# EAGLE schematic MRD104_MICROBOARD_APPS_A (EAGLE 9.2.2), part 1 of 2

## Sheet 1 of 3
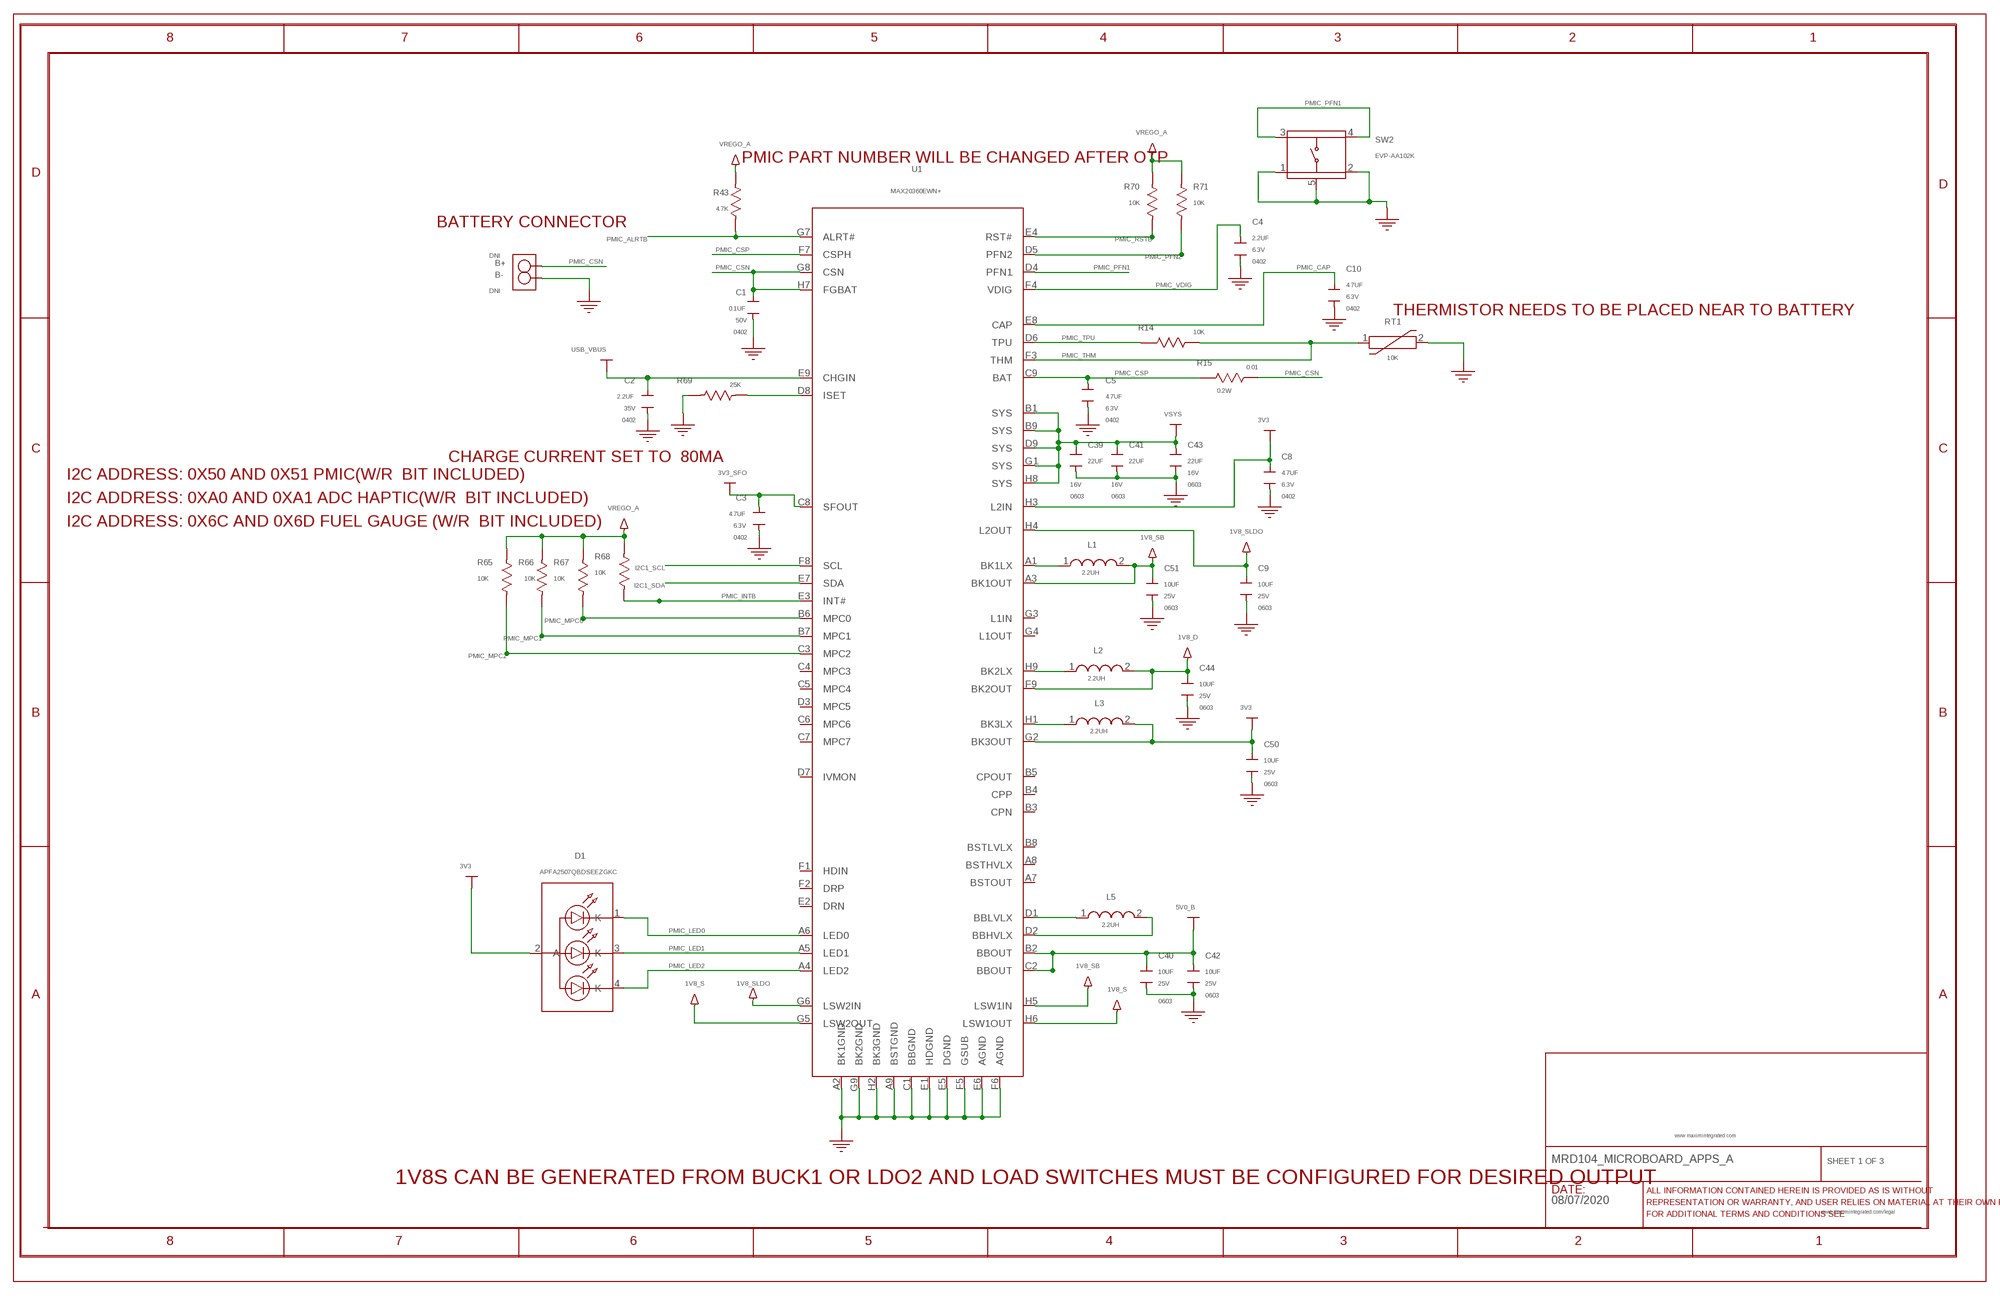
[diagram p0: schematic, sheet 1]
MAXIM_B_SIZE_CF_SYM_1_INST_0 (MAXIM_B_SIZE_CF): COLOR: Default; COMMENT_BODY: TRUE; CURRENT_DESIGN_SHEET: Page 1; CUSTOM_TXT_CDS21: SHEET 1 OF 3; DATE_TXT_CDS: 08/07/2020; DESIGN_CREATE_DATE: Monday, April 19, 2021; DESIGN_CREATE_TIME: 17:19:08; DESIGN_FILE_NAME: C:\TEST\ELGRIS\CHDL2EAGLE\MAXIM\MRD104\MRD104_MICROBOARD_APPS_A.DSN; DESIGN_MODIFY_DATE: Tuesday, April 20, 2021; DESIGN_MODIFY_TIME: 16:35:42; DESIGN_NAME: C:\TEST\ELGRIS\CHDL2EAGLE\MAXIM\MRD104\MRD104_MICROBOARD_APPS_A.DSN; LEGAL_WEBLINK_TXT_CDS: www.maximintegrated.com/legal; LOCATION_X-COORDINATE: 5; LOCATION_Y-COORDINATE: 9; ORIGINALSYMBOLORIGIN: (175,5230); PAGE_CREATE_DATE: Monday, April 19, 2021; PAGE_CREATE_TIME: 17:19:12; PAGE_MODIFY_DATE: Tuesday, April 20, 2021; PAGE_MODIFY_TIME: 16:35:42; PAGE_NUMBER: 1; PAGE_SIZE: Custom; PROJECT_TITLE_TXT_CDS: MRD104_MICROBOARD_APPS_A; SCHEMATIC_CREATE_DATE: Monday, April 19, 2021; SCHEMATIC_CREATE_TIME: 10:19:14; SCHEMATIC_MODIFY_DATE: Tuesday, April 20, 2021; SCHEMATIC_MODIFY_TIME: 09:35:44; SCHEMATIC_NAME: MRD104_MICROBOARD_APPS_A; SCHEMATIC_PAGE_COUNT: 3; SCHEMATIC_PAGE_NUMBER: 1; SOURCE_LIBRARY: D:\MAXIM\CHDL2EAGLE\19APR21\MAXREFDES104\MRD104_MICROBOARD_APPS_A\MML.OLB; SOURCE_SYMBOL: MAXIM_B_SIZE_CF; WEBLINK1_TXT_CDS: www.maximintegrated.com

### Parts
B+  N/A  TP  [KEYS_5001]
B-  N/A  TP  [KEYS_5001]
C1  0.1UF  CAP_NPCAP_NP_2  [0402]
C2  2.2UF  CAP_NPCAP_NP_2  [0402]
C3  4.7UF  CAP_NP#1CAP_NP#1_1  [0402]
C4  2.2UF  CAP_NPCAP_NP_2  [0402]
C5  4.7UF  CAP_NPCAP_NP_2  [0402]
C8  4.7UF  CAP_NPCAP_NP_2  [0402]
C9  10UF  CAP_NPCAP_NP_3  [0603]
C10  4.7UF  CAP_NPCAP_NP_2  [0402]
C39  22UF  CAP_NPCAP_NP_3  [0603]
C40  10UF  CAP_NPCAP_NP_3  [0603]
C41  22UF  CAP_NPCAP_NP_3  [0603]
C42  10UF  CAP_NPCAP_NP_3  [0603]
C43  22UF  CAP_NPCAP_NP_3  [0603]
C44  10UF  CAP_NPCAP_NP_3  [0603]
C50  10UF  CAP_NPCAP_NP_3  [0603]
C51  10UF  CAP_NPCAP_NP_3  [0603]
D1  APFA2507QBDSEEZGKC  LED_4P  [LED_APFA2507]
L1  2.2UH  INDUCTINDUCT_1  [IND_2016]
L2  2.2UH  INDUCTINDUCT_1  [IND_2016]
L3  2.2UH  INDUCTINDUCT_1  [IND_2016]
L5  2.2UH  INDUCTINDUCT_1  [IND_2016]
R14  10K  RES_SMD#1RES_SMD#1_1  [0402]
R15  0.01  RES_SMD#1RES_SMD#1_1  [0402]
R43  4.7K  RES_SMDRES_SMD_2  [0402]
R65  10K  RES_SMDRES_SMD_2  [0402]
R66  10K  RES_SMDRES_SMD_2  [0402]
R67  10K  RES_SMDRES_SMD_2  [0402]
R68  10K  RES_SMDRES_SMD_2  [0402]
R69  25K  RES_SMDRES_SMD_2  [0402]
R70  10K  RES_SMDRES_SMD_2  [0402]
R71  10K  RES_SMDRES_SMD_2  [0402]
RT1  10K  THERMISTOR_SMD  [THRMC0603X33M]
SW2  EVP-AA102K  EVP-AAXXXX  [SW_EVP-AAX02X_GND]
U1  MAX20360EWN+  EK_MAX20360  [MAXIM_21-100373]

### Nets
1V8_D: C44.2 L2.2 U1.F9(BK2OUT) ; also sheet 2,3
1V8_S: U1.G5(LSW2OUT) U1.H6(LSW1OUT) ; also sheet 2
1V8_SB: C51.2 L1.2 U1.A3(BK1OUT) U1.H5(LSW1IN)
1V8_SLDO: C9.2 U1.G6(LSW2IN) U1.H4(L2OUT)
3V3: C8.2 C50.2 D1.2(A) L3.2 U1.G2(BK3OUT) U1.H3(L2IN) ; also sheet 3
3V3_SFO: C3.1 U1.C8(SFOUT) ; also sheet 2,3
5V0_B: C40.2 C42.2 U1.B2(BBOUT) U1.C2(BBOUT) ; also sheet 2
GND_POWER: B-.1(TP1) C1.1 C2.1 C3.2 C4.1 C5.1 C8.1 C9.1 C10.1 C39.1 C40.1 C41.1 C42.1 C43.1 C44.1 C50.1 C51.1 R69.1 RT1.2 SW2.1 SW2.2 SW2.5 U1.A2(BK1GND) U1.A9(BSTGND) U1.C1(BBGND) U1.E1(HDGND) U1.E5(DGND) U1.E6(AGND) U1.F5(GSUB) U1.F6(AGND) U1.G9(BK2GND) U1.H2(BK3GND) ; also sheet 2,3
I2C1_SCL: U1.F8(SCL) ; also sheet 2,3
I2C1_SDA: U1.E7(SDA) ; also sheet 2,3
N00481: L1.1 U1.A1(BK1LX)
N00483: L5.1 U1.D1(BBLVLX)
N00485: L5.2 U1.D2(BBHVLX)
N00491: R69.2 U1.D8(ISET)
N00493: L3.1 U1.H1(BK3LX)
N00495: L2.1 U1.H9(BK2LX)
PMIC_ALRTB: R43.1 U1.G7(ALRT#) ; also sheet 3
PMIC_CAP: C10.2 U1.E8(CAP)
PMIC_CSN: B+.1(TP1) C1.2 R15.2 U1.G8(CSN) U1.H7(FGBAT)
PMIC_CSP: C5.2 R15.1 U1.C9(BAT) U1.F7(CSPH)
PMIC_INTB: R68.1 U1.E3(INT#) ; also sheet 3
PMIC_LED0: D1.1(K) U1.A6(LED0)
PMIC_LED1: D1.3(K) U1.A5(LED1)
PMIC_LED2: D1.4(K) U1.A4(LED2)
PMIC_MPC0: R67.1 U1.B6(MPC0) ; also sheet 3
PMIC_MPC1: R66.1 U1.B7(MPC1) ; also sheet 3
PMIC_MPC2: R65.1 U1.C3(MPC2) ; also sheet 3
PMIC_PFN1: SW2.3 SW2.4 U1.D4(PFN1)
PMIC_PFN2: R71.1 U1.D5(PFN2) ; also sheet 3
PMIC_RSTB: R70.1 U1.E4(RST#) ; also sheet 3
PMIC_THM: R14.2 RT1.1 U1.F3(THM)
PMIC_TPU: R14.1 U1.D6(TPU)
PMIC_VDIG: C4.2 U1.F4(VDIG)
USB_VBUS: C2.2 U1.E9(CHGIN) ; also sheet 2
VREGO_A: R43.2 R65.2 R66.2 R67.2 R68.2 R70.2 R71.2 ; also sheet 2,3
VSYS: C39.2 C41.2 C43.2 U1.B1(SYS) U1.B9(SYS) U1.D9(SYS) U1.G1(SYS) U1.H8(SYS)
Unconnected: U1.A7(BSTOUT) U1.A8(BSTHVLX) U1.B3(CPN) U1.B4(CPP) U1.B5(CPOUT) U1.B8(BSTLVLX) U1.C4(MPC3) U1.C5(MPC4) U1.C6(MPC6) U1.C7(MPC7) U1.D3(MPC5) U1.D7(IVMON) U1.E2(DRN) U1.F1(HDIN) U1.F2(DRP) U1.G3(L1IN) U1.G4(L1OUT)

### Notes on the sheet
- PMIC PART NUMBER WILL BE CHANGED AFTER OTP
- BATTERY CONNECTOR
- THERMISTOR NEEDS TO BE PLACED NEAR TO BATTERY
- CHARGE CURRENT SET TO  80MA
- I2C ADDRESS: 0X50 AND 0X51 PMIC(W/R  BIT INCLUDED)
- I2C ADDRESS: 0XA0 AND 0XA1 ADC HAPTIC(W/R  BIT INCLUDED)
- I2C ADDRESS: 0X6C AND 0X6D FUEL GAUGE (W/R  BIT INCLUDED)
- 1V8S CAN BE GENERATED FROM BUCK1 OR LDO2 AND LOAD SWITCHES MUST BE CONFIGURED FOR DESIRED OUTPUT

## Sheet 2 of 3
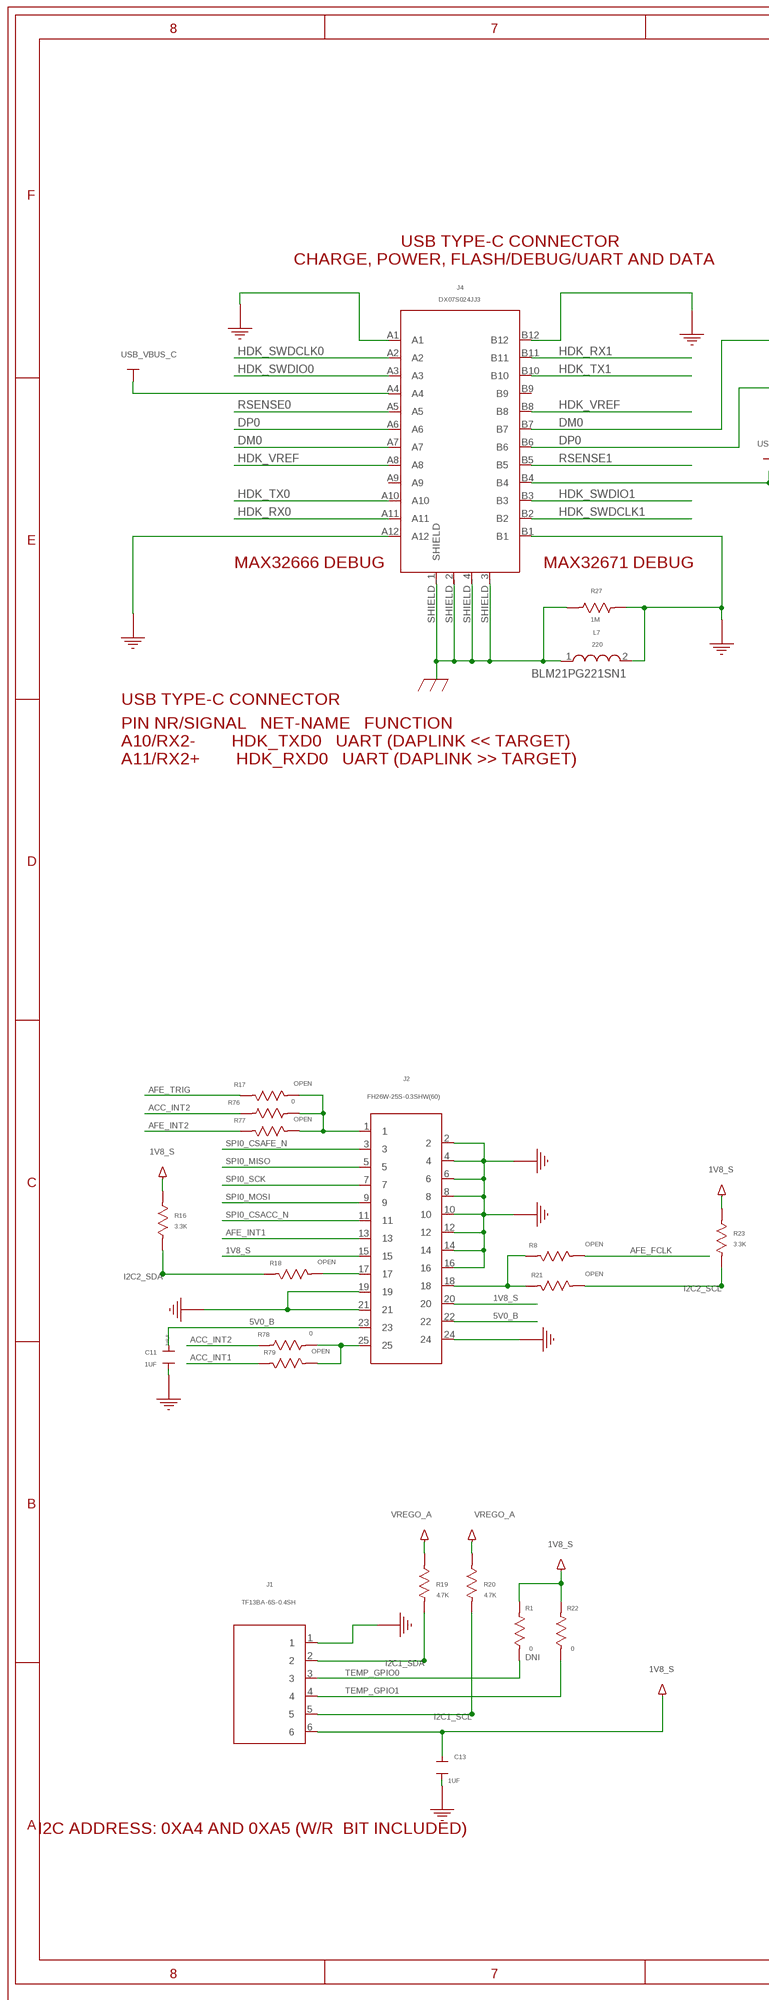
[diagram p1: schematic, sheet 2, part 1 of 2]
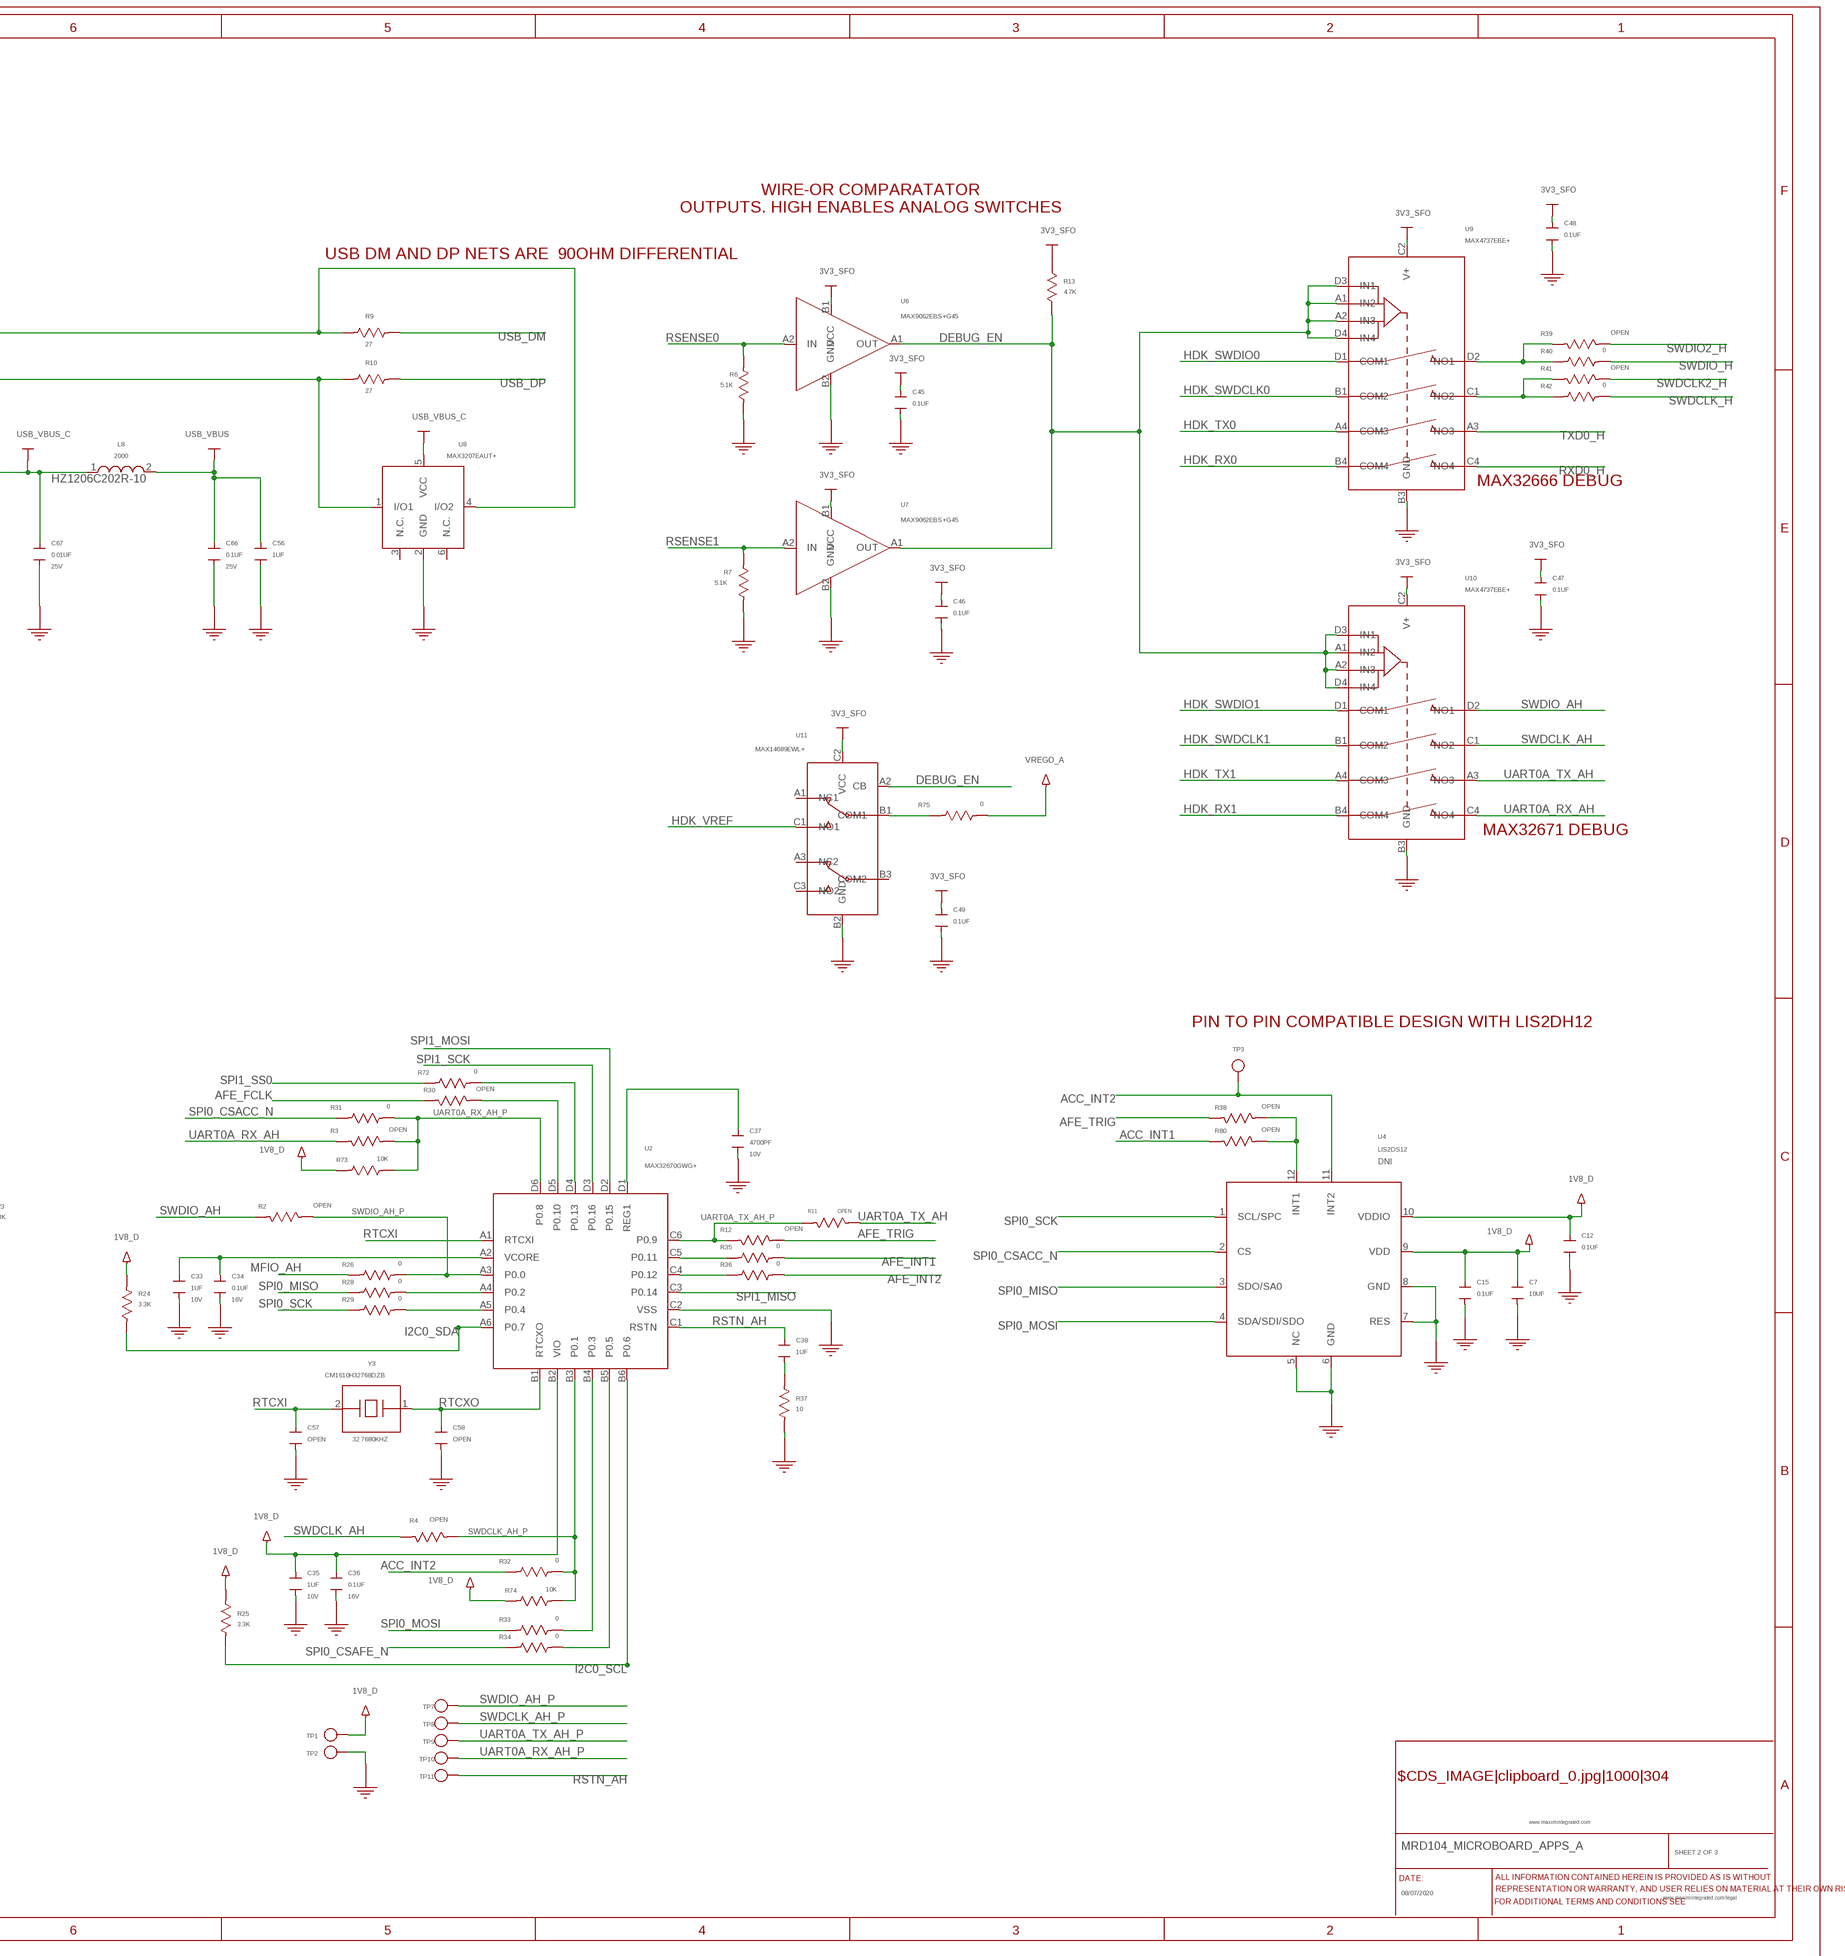
[diagram p2: schematic, sheet 2, part 2 of 2]
MAXIM_C_SIZE_CF_SYM_1_INST_1___1 (MAXIM_C_SIZE_CF): COLOR: Default; COMMENT_BODY: TRUE; CURRENT_DESIGN_SHEET: Page 2; CUSTOM_TXT_CDS21: SHEET 2 OF 3; DATE_TXT_CDS: 08/07/2020; DESIGN_CREATE_DATE: Monday, April 19, 2021; DESIGN_CREATE_TIME: 17:19:08; DESIGN_FILE_NAME: C:\TEST\ELGRIS\CHDL2EAGLE\MAXIM\MRD104\MRD104_MICROBOARD_APPS_A.DSN; DESIGN_MODIFY_DATE: Tuesday, April 20, 2021; DESIGN_MODIFY_TIME: 16:35:42; DESIGN_NAME: C:\TEST\ELGRIS\CHDL2EAGLE\MAXIM\MRD104\MRD104_MICROBOARD_APPS_A.DSN; LEGAL_WEBLINK_TXT_CDS: www.maximintegrated.com/legal; LOCATION_X-COORDINATE: 6; LOCATION_Y-COORDINATE: 2; ORIGINALSYMBOLORIGIN: (-9396,8292); PAGE_CREATE_DATE: Monday, April 19, 2021; PAGE_CREATE_TIME: 17:19:13; PAGE_MODIFY_DATE: Tuesday, April 20, 2021; PAGE_MODIFY_TIME: 16:35:42; PAGE_NUMBER: 2; PAGE_SIZE: Custom; PROJECT_TITLE_TXT_CDS: MRD104_MICROBOARD_APPS_A; SCHEMATIC_CREATE_DATE: Monday, April 19, 2021; SCHEMATIC_CREATE_TIME: 10:19:14; SCHEMATIC_MODIFY_DATE: Tuesday, April 20, 2021; SCHEMATIC_MODIFY_TIME: 09:35:44; SCHEMATIC_NAME: MRD104_MICROBOARD_APPS_A; SCHEMATIC_PAGE_COUNT: 3; SCHEMATIC_PAGE_NUMBER: 2; SOURCE_LIBRARY: D:\MAXIM\CHDL2EAGLE\19APR21\MAXREFDES104\MRD104_MICROBOARD_APPS_A\MML.OLB; SOURCE_SYMBOL: MAXIM_C_SIZE_CF; WEBLINK1_TXT_CDS: www.maximintegrated.com

### Parts
C7  10UF  CAP_NPCAP_NP_3  [0603]
C11  1UF  CAP_NP#1CAP_NP#1  [CAPC0603X33M]
C12  0.1UF  CAP_NPCAP_NP_1  [CAPC0603X33M]
C13  1UF  CAP_NP#1CAP_NP#1  [CAPC0603X33M]
C15  0.1UF  CAP_NPCAP_NP_1  [CAPC0603X33M]
C33  1UF  CAP_NPCAP_NP_1  [CAPC0603X33M]
C34  0.1UF  CAP_NPCAP_NP_1  [CAPC0603X33M]
C35  1UF  CAP_NPCAP_NP_1  [CAPC0603X33M]
C36  0.1UF  CAP_NPCAP_NP_1  [CAPC0603X33M]
C37  4700PF  CAP_NPCAP_NP_1  [CAPC0603X33M]
C38  1UF  CAP_NPCAP_NP_1  [CAPC0603X33M]
C45  0.1UF  CAP_NPCAP_NP_1  [CAPC0603X33M]
C46  0.1UF  CAP_NPCAP_NP_1  [CAPC0603X33M]
C47  0.1UF  CAP_NPCAP_NP_1  [CAPC0603X33M]
C48  0.1UF  CAP_NPCAP_NP_1  [CAPC0603X33M]
C49  0.1UF  CAP_NPCAP_NP_1  [CAPC0603X33M]
C56  1UF  CAP_NPCAP_NP_2  [0402]
C57  OPEN  EK_CAP_NP  [CAPC0603X23L]
C58  OPEN  EK_CAP_NP  [CAPC0603X23L]
C66  0.1UF  CAP_NPCAP_NP_1  [CAPC0603X33M]
C67  0.01UF  CAP_NPCAP_NP_2  [0402]
J1  TF13BA-6S-0.4SH  TF13BA-6S  [HRSC_TF13BA-6S-0_4SH]
J2  FH26W-25S-0.3SHW(60)  FH26-25S  [HRSC_FH26W-25S-0_3SHW]
J4  DX07S024JJ3  [JAE_DX07S024JJ3]
L7  220  FERRITEBEADFERRITEBEAD_1  [0805]
L8  2000  FERRITEBEADFERRITEBEAD  [1206]
R1  0  RES_SMDRES_SMD_1  [RESC0603X33M]
R2  OPEN  EK_RES_SMD  [RESC0603X23L]
R3  OPEN  EK_RES_SMD  [RESC0603X23L]
R4  OPEN  EK_RES_SMD  [RESC0603X23L]
R6  5.1K  RES_SMDRES_SMD_1  [RESC0603X33M]
R7  5.1K  RES_SMDRES_SMD_1  [RESC0603X33M]
R8  OPEN  EK_RES_SMD  [RESC0603X23L]
R9  27  RES_SMDRES_SMD_1  [RESC0603X33M]
R10  27  RES_SMDRES_SMD_1  [RESC0603X33M]
R11  OPEN  EK_RES_SMD  [RESC0603X23L]
R12  OPEN  EK_RES_SMD  [RESC0603X23L]
R13  4.7K  RES_SMD#1RES_SMD#1  [RESC0603X26M]
R16  3.3K  RES_SMDRES_SMD_1  [RESC0603X33M]
R17  OPEN  EK_RES_SMD  [RESC0603X23L]
R18  OPEN  EK_RES_SMD  [RESC0603X23L]
R19  4.7K  RES_SMDRES_SMD  [RESC0603X26M]
R20  4.7K  RES_SMDRES_SMD  [RESC0603X26M]
R21  OPEN  EK_RES_SMD  [RESC0603X23L]
R22  0  RES_SMDRES_SMD_1  [RESC0603X33M]
R23  3.3K  RES_SMDRES_SMD_1  [RESC0603X33M]
R24  3.3K  RES_SMDRES_SMD_1  [RESC0603X33M]
R25  3.3K  RES_SMDRES_SMD_1  [RESC0603X33M]
R26  0  RES_SMDRES_SMD_1  [RESC0603X33M]
R27  1M  RES_SMDRES_SMD_2  [0402]
R28  0  RES_SMDRES_SMD_1  [RESC0603X33M]
R29  0  RES_SMDRES_SMD_1  [RESC0603X33M]
R30  OPEN  EK_RES_SMD  [RESC0603X23L]
R31  0  RES_SMDRES_SMD_1  [RESC0603X33M]
R32  0  RES_SMDRES_SMD_1  [RESC0603X33M]
R33  0  RES_SMDRES_SMD_1  [RESC0603X33M]
R34  0  RES_SMDRES_SMD_1  [RESC0603X33M]
R35  0  RES_SMDRES_SMD_1  [RESC0603X33M]
R36  0  RES_SMDRES_SMD_1  [RESC0603X33M]
R37  10  RES_SMDRES_SMD_1  [RESC0603X33M]
R38  OPEN  EK_RES_SMD  [RESC0603X23L]
R39  OPEN  EK_RES_SMD  [RESC0603X23L]
R40  0  RES_SMDRES_SMD_1  [RESC0603X33M]
R41  OPEN  EK_RES_SMD  [RESC0603X23L]
R42  0  RES_SMDRES_SMD_1  [RESC0603X33M]
R72  0  RES_SMDRES_SMD_1  [RESC0603X33M]
R73  10K  RES_SMDRES_SMD_1  [RESC0603X33M]
R74  10K  RES_SMDRES_SMD_1  [RESC0603X33M]
R75  0  RES_SMDRES_SMD_1  [RESC0603X33M]
R76  0  RES_SMDRES_SMD_1  [RESC0603X33M]
R77  OPEN  EK_RES_SMD  [RESC0603X23L]
R78  0  RES_SMDRES_SMD_1  [RESC0603X33M]
R79  OPEN  EK_RES_SMD  [RESC0603X23L]
R80  OPEN  EK_RES_SMD  [RESC0603X23L]
TP1  TP14PAD  EVKIT_TP  [TP_CIR_0-3556]
TP2  TP14PAD  EVKIT_TP  [TP_CIR_0-3556]
TP3  TP14PAD  EVKIT_TP  [TP_CIR_0-3556]
TP7  TP14PAD  EVKIT_TP  [TP_CIR_0-3556]
TP8  TP14PAD  EVKIT_TP  [TP_CIR_0-3556]
TP9  TP14PAD  EVKIT_TP  [TP_CIR_0-3556]
TP10  TP14PAD  EVKIT_TP  [TP_CIR_0-3556]
TP11  TP14PAD  EVKIT_TP  [TP_CIR_0-3556]
U2  MAX32670GWG+  EK_MAX32670  [MAXIM_21-100511]
U4  LIS2DS12  [STMC_LGA-12]
U6  MAX9062EBS+G45  MAX9062  [MAXIM_21-0789]
U7  MAX9062EBS+G45  MAX9062  [MAXIM_21-0789]
U8  MAX3207EAUT+  MAX3207  [MAXIM_90-0175]
U9  MAX4737EBE+  MAX4737  [MAXIM_21-0101_B16-4]
U10  MAX4737EBE+  MAX4737  [MAXIM_21-0101_B16-4]
U11  MAX14689EWL+  MAX14689  [MAXIM_21-0459_W91B1-7]
Y3  32.7680KHZ  XTAL  [XTALDFN160X100X50-2M]

### Nets
1V8_D: C7.2 C12.2 C15.2 C35.2 C36.2 R24.2 R25.2 R73.1 R74.1 TP1.1(TP1) U2.B2(VIO) U4.9(VDD) U4.10(VDDIO) ; also sheet 1,3
1V8_S: C13.2 J1.6 J2.15 J2.20 R1.2 R16.2 R22.2 R23.2 ; also sheet 1
3V3_SFO: C45.2 C46.2 C47.2 C48.2 C49.2 R13.1 U6.B1(VCC) U7.B1(VCC) U9.C2(V+) U10.C2(V+) U11.C2(VCC) ; also sheet 1,3
5V0_B: C11.2 J2.22 J2.23 ; also sheet 1
ACC_INT1: R79.2 R80.2
ACC_INT2: R32.1 R76.1 R78.1 TP3.1(TP1) U4.11(INT2) ; also sheet 3
AFE_FCLK: R8.1 R30.2 ; also sheet 3
AFE_INT1: J2.13 R35.2 ; also sheet 3
AFE_INT2: R36.2 R77.2 ; also sheet 3
AFE_TRIG: R12.1 R17.2 R38.2 ; also sheet 3
DEBUG_EN: R13.2 U6.A1(OUT) U7.A1(OUT) U9.A1(IN2) U9.A2(IN3) U9.D3(IN1) U9.D4(IN4) U10.A1(IN2) U10.A2(IN3) U10.D3(IN1) U10.D4(IN4) U11.A2(CB)
DM0: J4.A7 J4.B7 R9.1 U8.4(I/O2)
DP0: J4.A6 J4.B6 R10.1 U8.1(I/O1)
GND_POWER: C7.1 C11.1 C12.1 C13.1 C15.1 C33.1 C34.1 C35.1 C36.1 C37.1 C45.1 C46.1 C47.1 C48.1 C49.1 C56.1 C57.1 C58.1 C66.1 C67.1 J1.1 J2.2 J2.4 J2.6 J2.8 J2.10 J2.12 J2.14 J2.16 J2.19 J2.21 J2.24 J4.A1 J4.A12 J4.B1 J4.B12 L7.2 R6.1 R7.1 R27.2 R37.1 TP2.1(TP1) U2.C2(VSS) U4.5(NC) U4.6(GND) U4.7(RES) U4.8(GND) U6.B2(GND) U7.B2(GND) U8.2(GND) U9.B3(GND) U10.B3(GND) U11.B2(GND) ; also sheet 1,3
HDK_RX0: J4.A11 U9.B4(COM4)
HDK_RX1: J4.B11 U10.B4(COM4)
HDK_SWDCLK0: J4.A2 U9.B1(COM2)
HDK_SWDCLK1: J4.B2 U10.B1(COM2)
HDK_SWDIO0: J4.A3 U9.D1(COM1)
HDK_SWDIO1: J4.B3 U10.D1(COM1)
HDK_TX0: J4.A10 U9.A4(COM3)
HDK_TX1: J4.B10 U10.A4(COM3)
HDK_VREF: J4.A8 J4.B8 U11.C1(NO1)
I2C0_SCL: R25.1 U2.B6(P0.6) ; also sheet 3
I2C0_SDA: R24.1 U2.A6(P0.7) ; also sheet 3
I2C1_SCL: J1.5 R20.1 ; also sheet 1,3
I2C1_SDA: J1.2 R19.1 ; also sheet 1,3
I2C2_SCL: R21.1 R23.1 ; also sheet 3
I2C2_SDA: R16.1 R18.2 ; also sheet 3
MFIO_AH: R26.1 ; also sheet 3
N01827: C37.2 U2.D1(REG1)
N01833: C38.1 R37.2
N01835: C33.2 C34.2 U2.A2(VCORE)
N01843: R28.2 U2.A4(P0.2)
N01845: R29.2 U2.A5(P0.4)
N01847: R33.2 U2.B4(P0.3)
N01851: R34.2 U2.B5(P0.5)
N01855: R36.1 U2.C4(P0.12)
N01857: R35.1 U2.C5(P0.11)
N01859: R72.2 U2.D4(P0.13)
N01863: R30.1 U2.D5(P0.10)
N01867: J2.1 R17.1 R76.2 R77.1
N01879: R41.2 R42.1 U9.C1(NO2)
N01887: R39.2 R40.1 U9.D2(NO1)
N01895: J2.25 R78.2 R79.1
N01903: J2.17 R18.1
N01905: J2.18 R8.2 R21.2
N01913: R38.1 R80.1 U4.12(INT1)
N01921: R75.1 U11.B1(COM1)
RSENSE0: J4.A5 R6.2 U6.A2(IN)
RSENSE1: J4.B5 R7.2 U7.A2(IN)
RSTN_AH: C38.2 TP11.1(TP1) U2.C1(RSTN) ; also sheet 3
RTCXI: C57.2 U2.A1(RTCXI) Y3.2
RTCXO: C58.2 U2.B1(RTCXO) Y3.1
RXD0_H: U9.C4(NO4) ; also sheet 3
SHIELD: J4.SHIELD_1(SHIELD) J4.SHIELD_2 J4.SHIELD_3(SHIELD_4) J4.SHIELD_4(SHIELD_3) L7.1 R27.1
SPI0_CSACC_N: J2.11 R31.1 U4.2(CS) ; also sheet 3
SPI0_CSAFE_N: J2.3 R34.1 ; also sheet 3
SPI0_MISO: J2.5 R28.1 U4.3(SDO/SA0) ; also sheet 3
SPI0_MOSI: J2.9 R33.1 U4.4(SDA/SDI/SDO) ; also sheet 3
SPI0_SCK: J2.7 R29.1 U4.1(SCL/SPC) ; also sheet 3
SPI1_MISO: U2.C3(P0.14) ; also sheet 3
SPI1_MOSI: U2.D2(P0.15) ; also sheet 3
SPI1_SCK: U2.D3(P0.16) ; also sheet 3
SPI1_SS0: R72.1 ; also sheet 3
SWDCLK2_H: R41.1 ; also sheet 3
SWDCLK_AH: R4.2 U10.C1(NO2)
SWDCLK_AH_P: R4.1 R32.2 R74.2 TP8.1(TP1) U2.B3(P0.1)
SWDCLK_H: R42.2 ; also sheet 3
SWDIO2_H: R39.1 ; also sheet 3
SWDIO_AH: R2.2 U10.D2(NO1)
SWDIO_AH_P: R2.1 R26.2 TP7.1(TP1) U2.A3(P0.0)
SWDIO_H: R40.2 ; also sheet 3
TEMP_GPIO0: J1.3 R1.1
TEMP_GPIO1: J1.4 R22.1
TXD0_H: U9.A3(NO3) ; also sheet 3
UART0A_RX_AH: R3.2 U10.C4(NO4)
UART0A_RX_AH_P: R3.1 R31.2 R73.2 TP10.1(TP1) U2.D6(P0.8)
UART0A_TX_AH: R11.1 U10.A3(NO3)
UART0A_TX_AH_P: R11.2 R12.2 TP9.1(TP1) U2.C6(P0.9)
USB_DM: R9.2 ; also sheet 3
USB_DP: R10.2 ; also sheet 3
USB_VBUS: C56.2 C66.2 L8.2 ; also sheet 1
USB_VBUS_C: C67.2 J4.A4 J4.B4 L8.1 U8.5(VCC)
VREGO_A: R19.2 R20.2 R75.2 ; also sheet 1,3
Unconnected: J4.A9 J4.B9 U8.3(N.C.) U8.6(N.C.) U11.A1(NC1) U11.A3(NC2) U11.B3(COM2) U11.C3(NO2)

### Notes on the sheet
- WIRE-OR COMPARATATOR
- OUTPUTS. HIGH ENABLES ANALOG SWITCHES
- USB TYPE-C CONNECTOR
- CHARGE, POWER, FLASH/DEBUG/UART AND DATA | USB DM AND DP NETS ARE  90OHM DIFFERENTIAL
- MAX32666 DEBUG
- MAX32666 DEBUG | MAX32671 DEBUG
- USB TYPE-C CONNECTOR
- PIN NR/SIGNAL   NET-NAME   FUNCTION
- A10/RX2-        HDK_TXD0   UART (DAPLINK << TARGET)
- A11/RX2+        HDK_RXD0   UART (DAPLINK >> TARGET)
- MAX32671 DEBUG
- PIN TO PIN COMPATIBLE DESIGN WITH LIS2DH12
- I2C ADDRESS: 0XA4 AND 0XA5 (W/R  BIT INCLUDED)

## Sheet 3 of 3
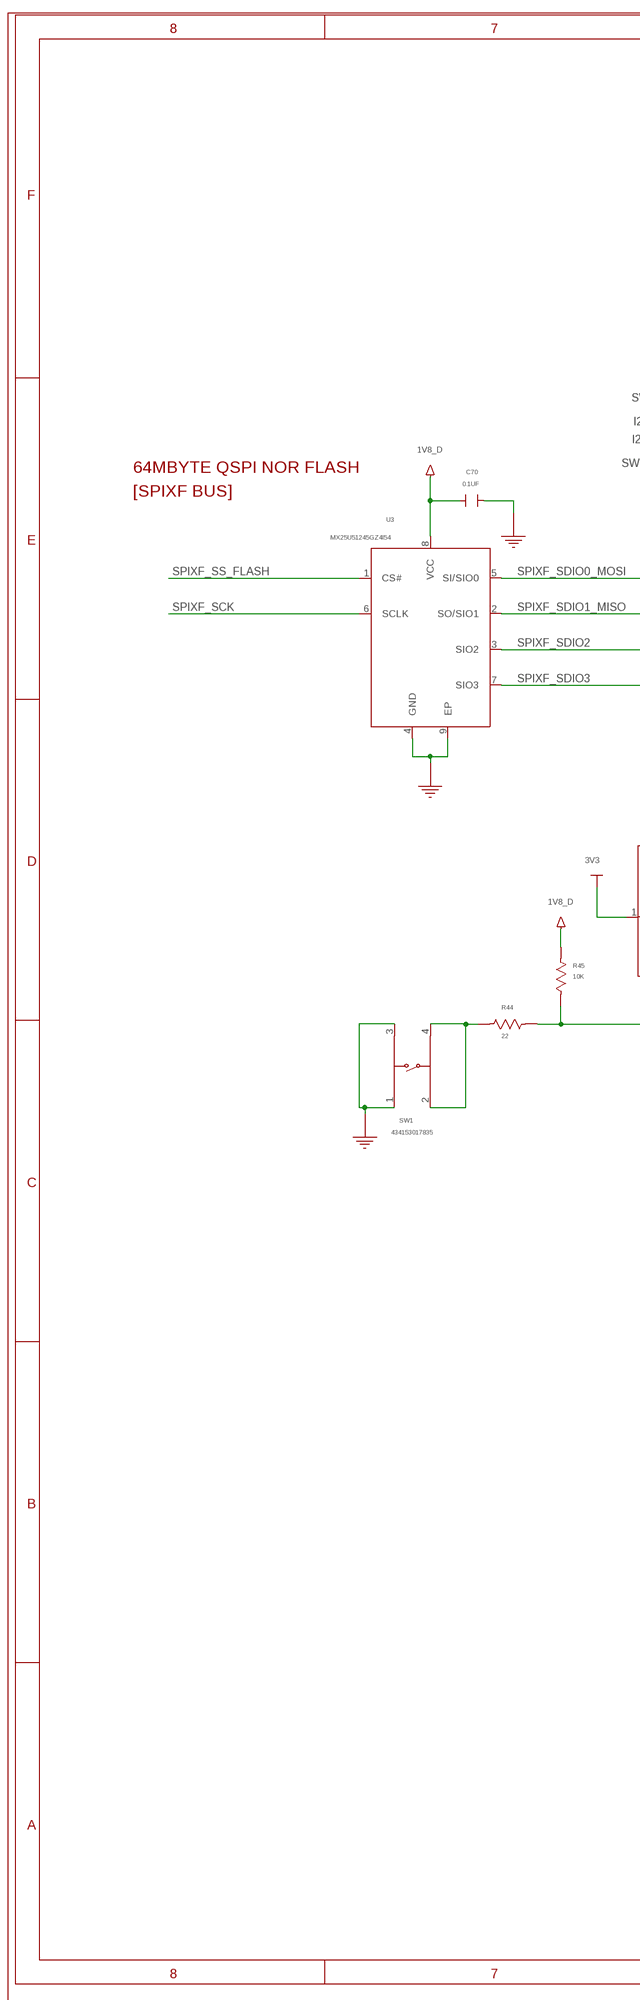
[diagram p3: schematic, sheet 3, part 1 of 2]
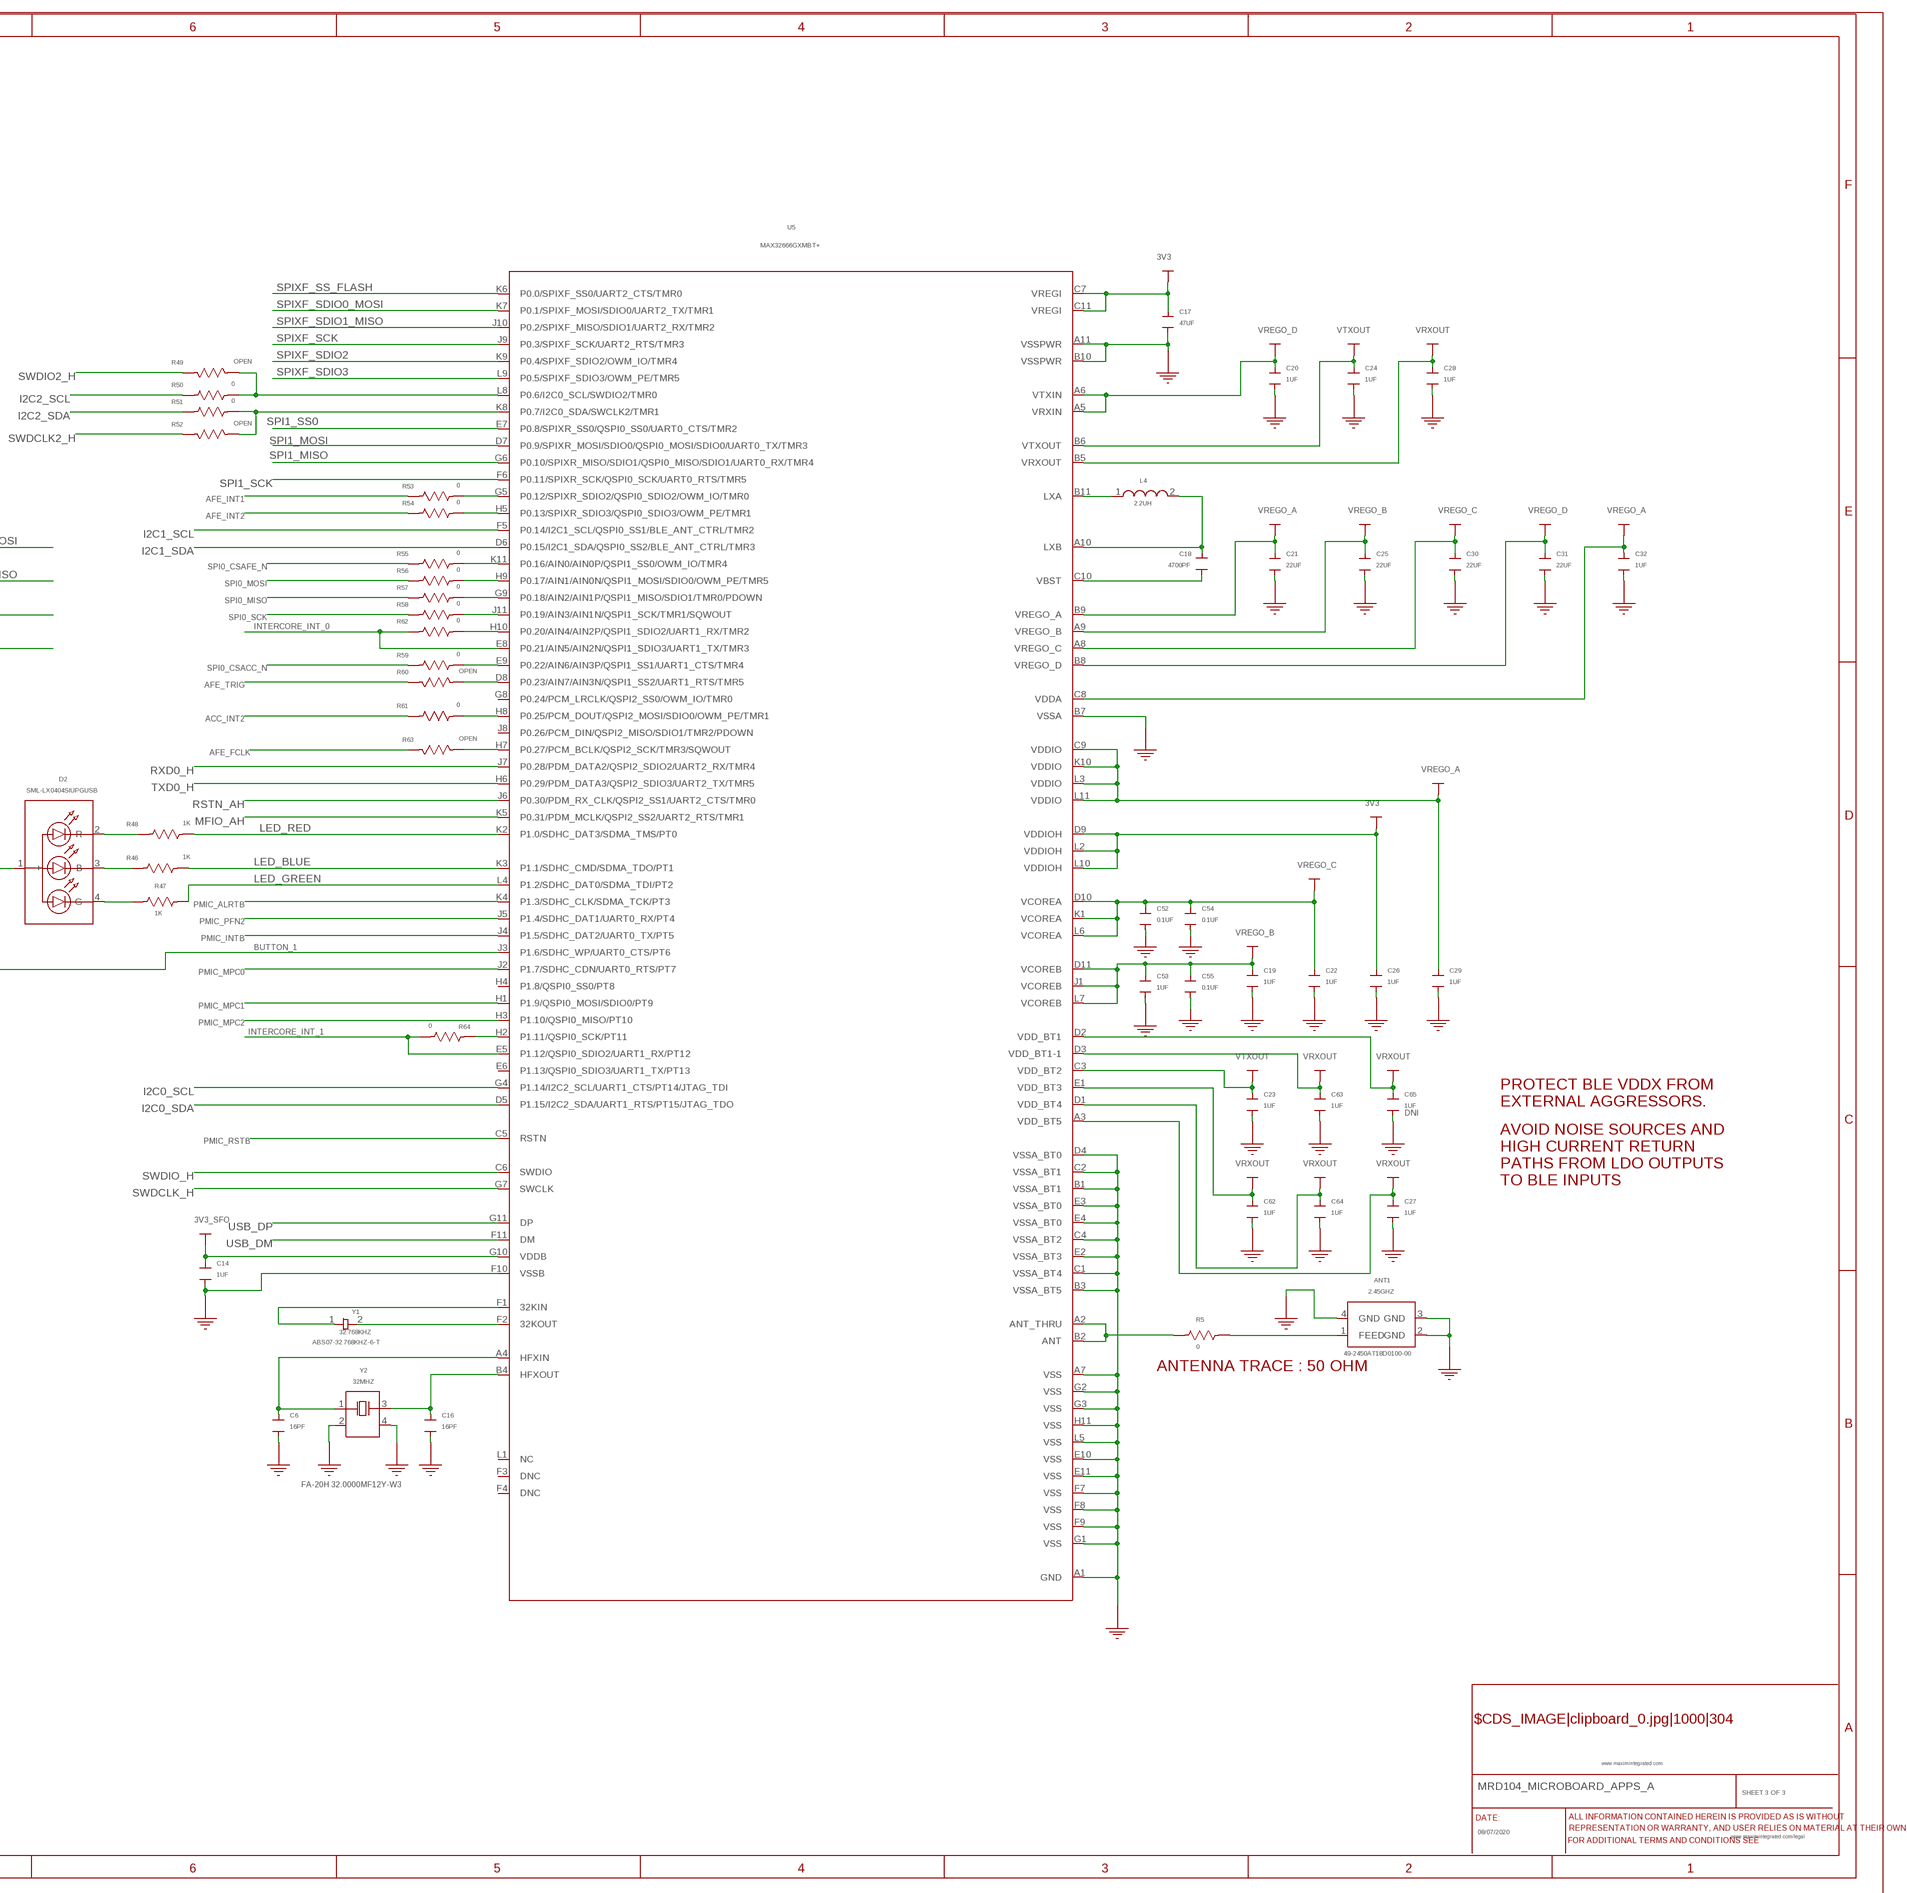
[diagram p4: schematic, sheet 3, part 2 of 2]
MAXIM_C_SIZE_CF_SYM_1_INST_2___2 (MAXIM_C_SIZE_CF): COLOR: Default; COMMENT_BODY: TRUE; CURRENT_DESIGN_SHEET: Page 3; CUSTOM_TXT_CDS21: SHEET 3 OF 3; DATE_TXT_CDS: 08/07/2020; DESIGN_CREATE_DATE: Monday, April 19, 2021; DESIGN_CREATE_TIME: 17:19:08; DESIGN_FILE_NAME: C:\TEST\ELGRIS\CHDL2EAGLE\MAXIM\MRD104\MRD104_MICROBOARD_APPS_A.DSN; DESIGN_MODIFY_DATE: Tuesday, April 20, 2021; DESIGN_MODIFY_TIME: 16:35:42; DESIGN_NAME: C:\TEST\ELGRIS\CHDL2EAGLE\MAXIM\MRD104\MRD104_MICROBOARD_APPS_A.DSN; LEGAL_WEBLINK_TXT_CDS: www.maximintegrated.com/legal; LOCATION_X-COORDINATE: 6; LOCATION_Y-COORDINATE: -3; ORIGINALSYMBOLORIGIN: (-9396,8292); PAGE_CREATE_DATE: Monday, April 19, 2021; PAGE_CREATE_TIME: 17:19:13; PAGE_MODIFY_DATE: Tuesday, April 20, 2021; PAGE_MODIFY_TIME: 16:35:42; PAGE_NUMBER: 3; PAGE_SIZE: Custom; PROJECT_TITLE_TXT_CDS: MRD104_MICROBOARD_APPS_A; SCHEMATIC_CREATE_DATE: Monday, April 19, 2021; SCHEMATIC_CREATE_TIME: 10:19:14; SCHEMATIC_MODIFY_DATE: Tuesday, April 20, 2021; SCHEMATIC_MODIFY_TIME: 09:35:44; SCHEMATIC_NAME: MRD104_MICROBOARD_APPS_A; SCHEMATIC_PAGE_COUNT: 3; SCHEMATIC_PAGE_NUMBER: 3; SOURCE_LIBRARY: D:\MAXIM\CHDL2EAGLE\19APR21\MAXREFDES104\MRD104_MICROBOARD_APPS_A\MML.OLB; SOURCE_SYMBOL: MAXIM_C_SIZE_CF; WEBLINK1_TXT_CDS: www.maximintegrated.com

### Parts
ANT1  2.45GHZ  ANTENNA  [ANT_2450AT18D0100]
C6  16PF  CAP_NPCAP_NP_1  [CAPC0603X33M]
C14  1UF  CAP_NPCAP_NP_1  [CAPC0603X33M]
C16  16PF  CAP_NPCAP_NP_1  [CAPC0603X33M]
C17  47UF  CAP_NPCAP_NP  [CAPC2012X140M]
C18  4700PF  CAP_NPCAP_NP_1  [CAPC0603X33M]
C19  1UF  CAP_NPCAP_NP_2  [0402]
C20  1UF  CAP_NPCAP_NP_2  [0402]
C21  22UF  CAP_NPCAP_NP_3  [0603]
C22  1UF  CAP_NPCAP_NP_2  [0402]
C23  1UF  CAP_NPCAP_NP_2  [0402]
C24  1UF  CAP_NPCAP_NP_2  [0402]
C25  22UF  CAP_NPCAP_NP_3  [0603]
C26  1UF  CAP_NPCAP_NP_2  [0402]
C27  1UF  CAP_NPCAP_NP_2  [0402]
C28  1UF  CAP_NPCAP_NP_2  [0402]
C29  1UF  CAP_NPCAP_NP_2  [0402]
C30  22UF  CAP_NPCAP_NP_3  [0603]
C31  22UF  CAP_NPCAP_NP_3  [0603]
C32  1UF  CAP_NPCAP_NP_2  [0402]
C52  0.1UF  CAP_NPCAP_NP_1  [CAPC0603X33M]
C53  1UF  CAP_NPCAP_NP_2  [0402]
C54  0.1UF  CAP_NPCAP_NP_1  [CAPC0603X33M]
C55  0.1UF  CAP_NPCAP_NP_1  [CAPC0603X33M]
C62  1UF  CAP_NPCAP_NP_2  [0402]
C63  1UF  CAP_NPCAP_NP_2  [0402]
C64  1UF  CAP_NPCAP_NP_2  [0402]
C65  1UF  CAP_NPCAP_NP_2  [0402]
C70  0.1UF  CAP_NPCAP_NP_1  [CAPC0603X33M]
D2  SML-LX0404SIUPGUSB  LED_4P#1  [LED_LX0404]
L4  2.2UH  INDUCTINDUCT  [0805]
R5  0  RES_SMDRES_SMD_2  [0402]
R44  22  RES_SMDRES_SMD_2  [0402]
R45  10K  RES_SMDRES_SMD_2  [0402]
R46  1K  RES_SMDRES_SMD_2  [0402]
R47  1K  RES_SMDRES_SMD_2  [0402]
R48  1K  RES_SMDRES_SMD_2  [0402]
R49  OPEN  EK_RES_SMD  [RESC0603X23L]
R50  0  RES_SMDRES_SMD_1  [RESC0603X33M]
R51  0  RES_SMDRES_SMD_1  [RESC0603X33M]
R52  OPEN  EK_RES_SMD  [RESC0603X23L]
R53  0  RES_SMDRES_SMD_1  [RESC0603X33M]
R54  0  RES_SMDRES_SMD_1  [RESC0603X33M]
R55  0  RES_SMDRES_SMD_1  [RESC0603X33M]
R56  0  RES_SMDRES_SMD_1  [RESC0603X33M]
R57  0  RES_SMDRES_SMD_1  [RESC0603X33M]
R58  0  RES_SMDRES_SMD_1  [RESC0603X33M]
R59  0  RES_SMDRES_SMD_1  [RESC0603X33M]
R60  OPEN  EK_RES_SMD  [RESC0603X23L]
R61  0  RES_SMDRES_SMD_1  [RESC0603X33M]
R62  0  RES_SMDRES_SMD_1  [RESC0603X33M]
R63  OPEN  EK_RES_SMD  [RESC0603X23L]
R64  0  RES_SMDRES_SMD_1  [RESC0603X33M]
SW1  434153017835  [SW_434153017835]
U3  MX25U51245GZ4I54  MX25U51245G_54  [SON127P600X800X80-9M]
U5  MAX32666GXMBT+  MAX32666  [MAXIM_21-0680]
Y1  32.768KHZ  XTAL#1  [XTAL320X150X90M]
Y2  32MHZ  XTAL#2  [OSCCC250X200X55M]

### Nets
1V8_D: C70.2 R45.2 U3.8(VCC) ; also sheet 1,2
3V3: C17.2 C26.2 D2.1(+) U5.C7(VREGI) U5.C11(VREGI) U5.D9(VDDIOH) U5.L2(VDDIOH) U5.L10(VDDIOH) ; also sheet 1
3V3_SFO: C14.2 U5.G10(VDDB) ; also sheet 1,2
ACC_INT2: R61.1 ; also sheet 2
AFE_FCLK: R63.2 ; also sheet 2
AFE_INT1: R53.1 ; also sheet 2
AFE_INT2: R54.1 ; also sheet 2
AFE_TRIG: R60.2 ; also sheet 2
BUTTON_1: R44.2 R45.1 U5.J3(P1.6/SDHC_WP/UART0_CTS/PT6)
GND_POWER: ANT1.2(GND) ANT1.3(GND) ANT1.4(GND) C6.1 C14.1 C16.1 C17.1 C19.1 C20.1 C21.1 C22.1 C23.1 C24.1 C25.1 C26.1 C27.1 C28.1 C29.1 C30.1 C31.1 C32.1 C52.1 C53.1 C54.1 C55.1 C62.1 C63.1 C64.1 C65.1 C70.1 SW1.1 SW1.3 U3.4(GND) U3.9(EP) U5.A1(GND) U5.A7(VSS) U5.A11(VSSPWR) U5.B1(VSSA_BT1) U5.B3(VSSA_BT5) U5.B7(VSSA) U5.B10(VSSPWR) U5.C1(VSSA_BT4) U5.C2(VSSA_BT1) U5.C4(VSSA_BT2) U5.D4(VSSA_BT0) U5.E2(VSSA_BT3) U5.E3(VSSA_BT0) U5.E4(VSSA_BT0) U5.E10(VSS) U5.E11(VSS) U5.F7(VSS) U5.F8(VSS) U5.F9(VSS) U5.F10(VSSB) U5.G1(VSS) U5.G2(VSS) U5.G3(VSS) U5.H11(VSS) U5.L5(VSS) Y2.2(NC1) Y2.4(NC2) ; also sheet 1,2
I2C0_SCL: U5.G4(P1.14/I2C2_SCL/UART1_CTS/PT14/JTAG_TDI) ; also sheet 2
I2C0_SDA: U5.D5(P1.15/I2C2_SDA/UART1_RTS/PT15/JTAG_TDO) ; also sheet 2
I2C1_SCL: U5.F5(P0.14/I2C1_SCL/QSPI0_SS1/BLE_ANT_CTRL/TMR2) ; also sheet 1,2
I2C1_SDA: U5.D6(P0.15/I2C1_SDA/QSPI0_SS2/BLE_ANT_CTRL/TMR3) ; also sheet 1,2
I2C2_SCL: R50.1 ; also sheet 2
I2C2_SDA: R51.1 ; also sheet 2
INTERCORE_INT_0: R62.1 U5.E8(P0.21/AIN5/AIN2N/QSPI1_SDIO3/UART1_TX/TMR3)
INTERCORE_INT_1: R64.1 U5.E5(P1.12/QSPI0_SDIO2/UART1_RX/PT12)
LED_BLUE: R46.2 U5.K3(P1.1/SDHC_CMD/SDMA_TDO/PT1)
LED_GREEN: R47.2 U5.L4(P1.2/SDHC_DAT0/SDMA_TDI/PT2)
LED_RED: R48.2 U5.K2(P1.0/SDHC_DAT3/SDMA_TMS/PT0)
MFIO_AH: U5.K5(P0.31/PDM_MCLK/QSPI2_SS2/UART2_RTS/TMR1) ; also sheet 2
N03072: R44.1 SW1.2 SW1.4
N03080: ANT1.1(FEED) R5.2
N03082: C18.1 U5.C10(VBST)
N03086: C18.2 L4.2 U5.A10(LXB)
N03094: C16.2 U5.B4(HFXOUT) Y2.3(P2)
N03102: C6.2 U5.A4(HFXIN) Y2.1
N03110: R60.1 U5.D8(P0.23/AIN7/AIN3N/QSPI1_SS2/UART1_RTS/TMR5)
N03112: R49.1 R50.2 U5.L8(P0.6/I2C0_SCL/SWDIO2/TMR0)
N03120: R51.2 R52.1 U5.K8(P0.7/I2C0_SDA/SWCLK2/TMR1)
N03128: L4.1 U5.B11(LXA)
N03130: D2.3(B) R46.1
N03132: D2.4(G) R47.1
N03134: D2.2(R) R48.1
N03136: U5.F1(32KIN) Y1.1
N03142: U5.F2(32KOUT) Y1.2
N03144: R5.1 U5.A2(ANT_THRU) U5.B2(ANT)
N03154: R61.2 U5.H8(P0.25/PCM_DOUT/QSPI2_MOSI/SDIO0/OWM_PE/TMR1)
N03156: R62.2 U5.H10(P0.20/AIN4/AIN2P/QSPI1_SDIO2/UART1_RX/TMR2)
N03158: R55.2 U5.K11(P0.16/AIN0/AIN0P/QSPI1_SS0/OWM_IO/TMR4)
N03160: R58.2 U5.J11(P0.19/AIN3/AIN1N/QSPI1_SCK/TMR1/SQWOUT)
N03162: R57.2 U5.G9(P0.18/AIN2/AIN1P/QSPI1_MISO/SDIO1/TMR0/PDOWN)
N03164: R63.1 U5.H7(P0.27/PCM_BCLK/QSPI2_SCK/TMR3/SQWOUT)
N03166: R56.2 U5.H9(P0.17/AIN1/AIN0N/QSPI1_MOSI/SDIO0/OWM_PE/TMR5)
N03168: R54.2 U5.H5(P0.13/SPIXR_SDIO3/QSPI0_SDIO3/OWM_PE/TMR1)
N03170: R53.2 U5.G5(P0.12/SPIXR_SDIO2/QSPI0_SDIO2/OWM_IO/TMR0)
N03172: R59.2 U5.E9(P0.22/AIN6/AIN3P/QSPI1_SS1/UART1_CTS/TMR4)
N03174: R64.2 U5.H2(P1.11/QSPI0_SCK/PT11)
PMIC_ALRTB: U5.K4(P1.3/SDHC_CLK/SDMA_TCK/PT3) ; also sheet 1
PMIC_INTB: U5.J4(P1.5/SDHC_DAT2/UART0_TX/PT5) ; also sheet 1
PMIC_MPC0: U5.J2(P1.7/SDHC_CDN/UART0_RTS/PT7) ; also sheet 1
PMIC_MPC1: U5.H1(P1.9/QSPI0_MOSI/SDIO0/PT9) ; also sheet 1
PMIC_MPC2: U5.H3(P1.10/QSPI0_MISO/PT10) ; also sheet 1
PMIC_PFN2: U5.J5(P1.4/SDHC_DAT1/UART0_RX/PT4) ; also sheet 1
PMIC_RSTB: U5.C5(RSTN) ; also sheet 1
RSTN_AH: U5.J6(P0.30/PDM_RX_CLK/QSPI2_SS1/UART2_CTS/TMR0) ; also sheet 2
RXD0_H: U5.J7(P0.28/PDM_DATA2/QSPI2_SDIO2/UART2_RX/TMR4) ; also sheet 2
SPI0_CSACC_N: R59.1 ; also sheet 2
SPI0_CSAFE_N: R55.1 ; also sheet 2
SPI0_MISO: R57.1 ; also sheet 2
SPI0_MOSI: R56.1 ; also sheet 2
SPI0_SCK: R58.1 ; also sheet 2
SPI1_MISO: U5.G6(P0.10/SPIXR_MISO/SDIO1/QSPI0_MISO/SDIO1/UART0_RX/TMR4) ; also sheet 2
SPI1_MOSI: U5.D7(P0.9/SPIXR_MOSI/SDIO0/QSPI0_MOSI/SDIO0/UART0_TX/TMR3) ; also sheet 2
SPI1_SCK: U5.F6(P0.11/SPIXR_SCK/QSPI0_SCK/UART0_RTS/TMR5) ; also sheet 2
SPI1_SS0: U5.E7(P0.8/SPIXR_SS0/QSPI0_SS0/UART0_CTS/TMR2) ; also sheet 2
SPIXF_SCK: U3.6(SCLK) U5.J9(P0.3/SPIXF_SCK/UART2_RTS/TMR3)
SPIXF_SDIO0_MOSI: U3.5(SI/SIO0) U5.K7(P0.1/SPIXF_MOSI/SDIO0/UART2_TX/TMR1)
SPIXF_SDIO1_MISO: U3.2(SO/SIO1) U5.J10(P0.2/SPIXF_MISO/SDIO1/UART2_RX/TMR2)
SPIXF_SDIO2: U3.3(SIO2) U5.K9(P0.4/SPIXF_SDIO2/OWM_IO/TMR4)
SPIXF_SDIO3: U3.7(SIO3) U5.L9(P0.5/SPIXF_SDIO3/OWM_PE/TMR5)
SPIXF_SS_FLASH: U3.1(CS#) U5.K6(P0.0/SPIXF_SS0/UART2_CTS/TMR0)
SWDCLK2_H: R52.2 ; also sheet 2
SWDCLK_H: U5.G7(SWCLK) ; also sheet 2
SWDIO2_H: R49.2 ; also sheet 2
SWDIO_H: U5.C6(SWDIO) ; also sheet 2
TXD0_H: U5.H6(P0.29/PDM_DATA3/QSPI2_SDIO3/UART2_TX/TMR5) ; also sheet 2
USB_DM: U5.F11(DM) ; also sheet 2
USB_DP: U5.G11(DP) ; also sheet 2
VREGO_A: C21.2 C29.2 C32.2 U5.B9(VREGO_A) U5.C8(VDDA) U5.C9(VDDIO) U5.K10(VDDIO) U5.L3(VDDIO) U5.L11(VDDIO) ; also sheet 1,2
VREGO_B: C19.2 C25.2 C53.2 C55.2 U5.A9(VREGO_B) U5.D11(VCOREB) U5.J1(VCOREB) U5.L7(VCOREB)
VREGO_C: C22.2 C30.2 C52.2 C54.2 U5.A8(VREGO_C) U5.D10(VCOREA) U5.K1(VCOREA) U5.L6(VCOREA)
VREGO_D: C20.2 C31.2 U5.A5(VRXIN) U5.A6(VTXIN) U5.B8(VREGO_D)
VRXOUT: C27.2 C28.2 C62.2 C63.2 C64.2 C65.2 U5.A3(VDD_BT5) U5.B5(VRXOUT) U5.D1(VDD_BT4) U5.D2(VDD_BT1) U5.D3(VDD_BT1-1) U5.E1(VDD_BT3)
VTXOUT: C23.2 C24.2 U5.B6(VTXOUT) U5.C3(VDD_BT2)
Unconnected: U5.E6(P1.13/QSPI0_SDIO3/UART1_TX/PT13) U5.F3(DNC) U5.F4(DNC) U5.G8(P0.24/PCM_LRCLK/QSPI2_SS0/OWM_IO/TMR0) U5.H4(P1.8/QSPI0_SS0/PT8) U5.J8(P0.26/PCM_DIN/QSPI2_MISO/SDIO1/TMR2/PDOWN) U5.L1(NC)

### Notes on the sheet
- 64MBYTE QSPI NOR FLASH
- [SPIXF BUS]
- PROTECT BLE VDDX FROM
- EXTERNAL AGGRESSORS.
- AVOID NOISE SOURCES AND
- HIGH CURRENT RETURN
- PATHS FROM LDO OUTPUTS
- TO BLE INPUTS
- ANTENNA TRACE : 50 OHM